# Altium schematic sheet DDR4 Memory.SchDoc
size A3; SheetNumber: 7; SheetTotal: 16
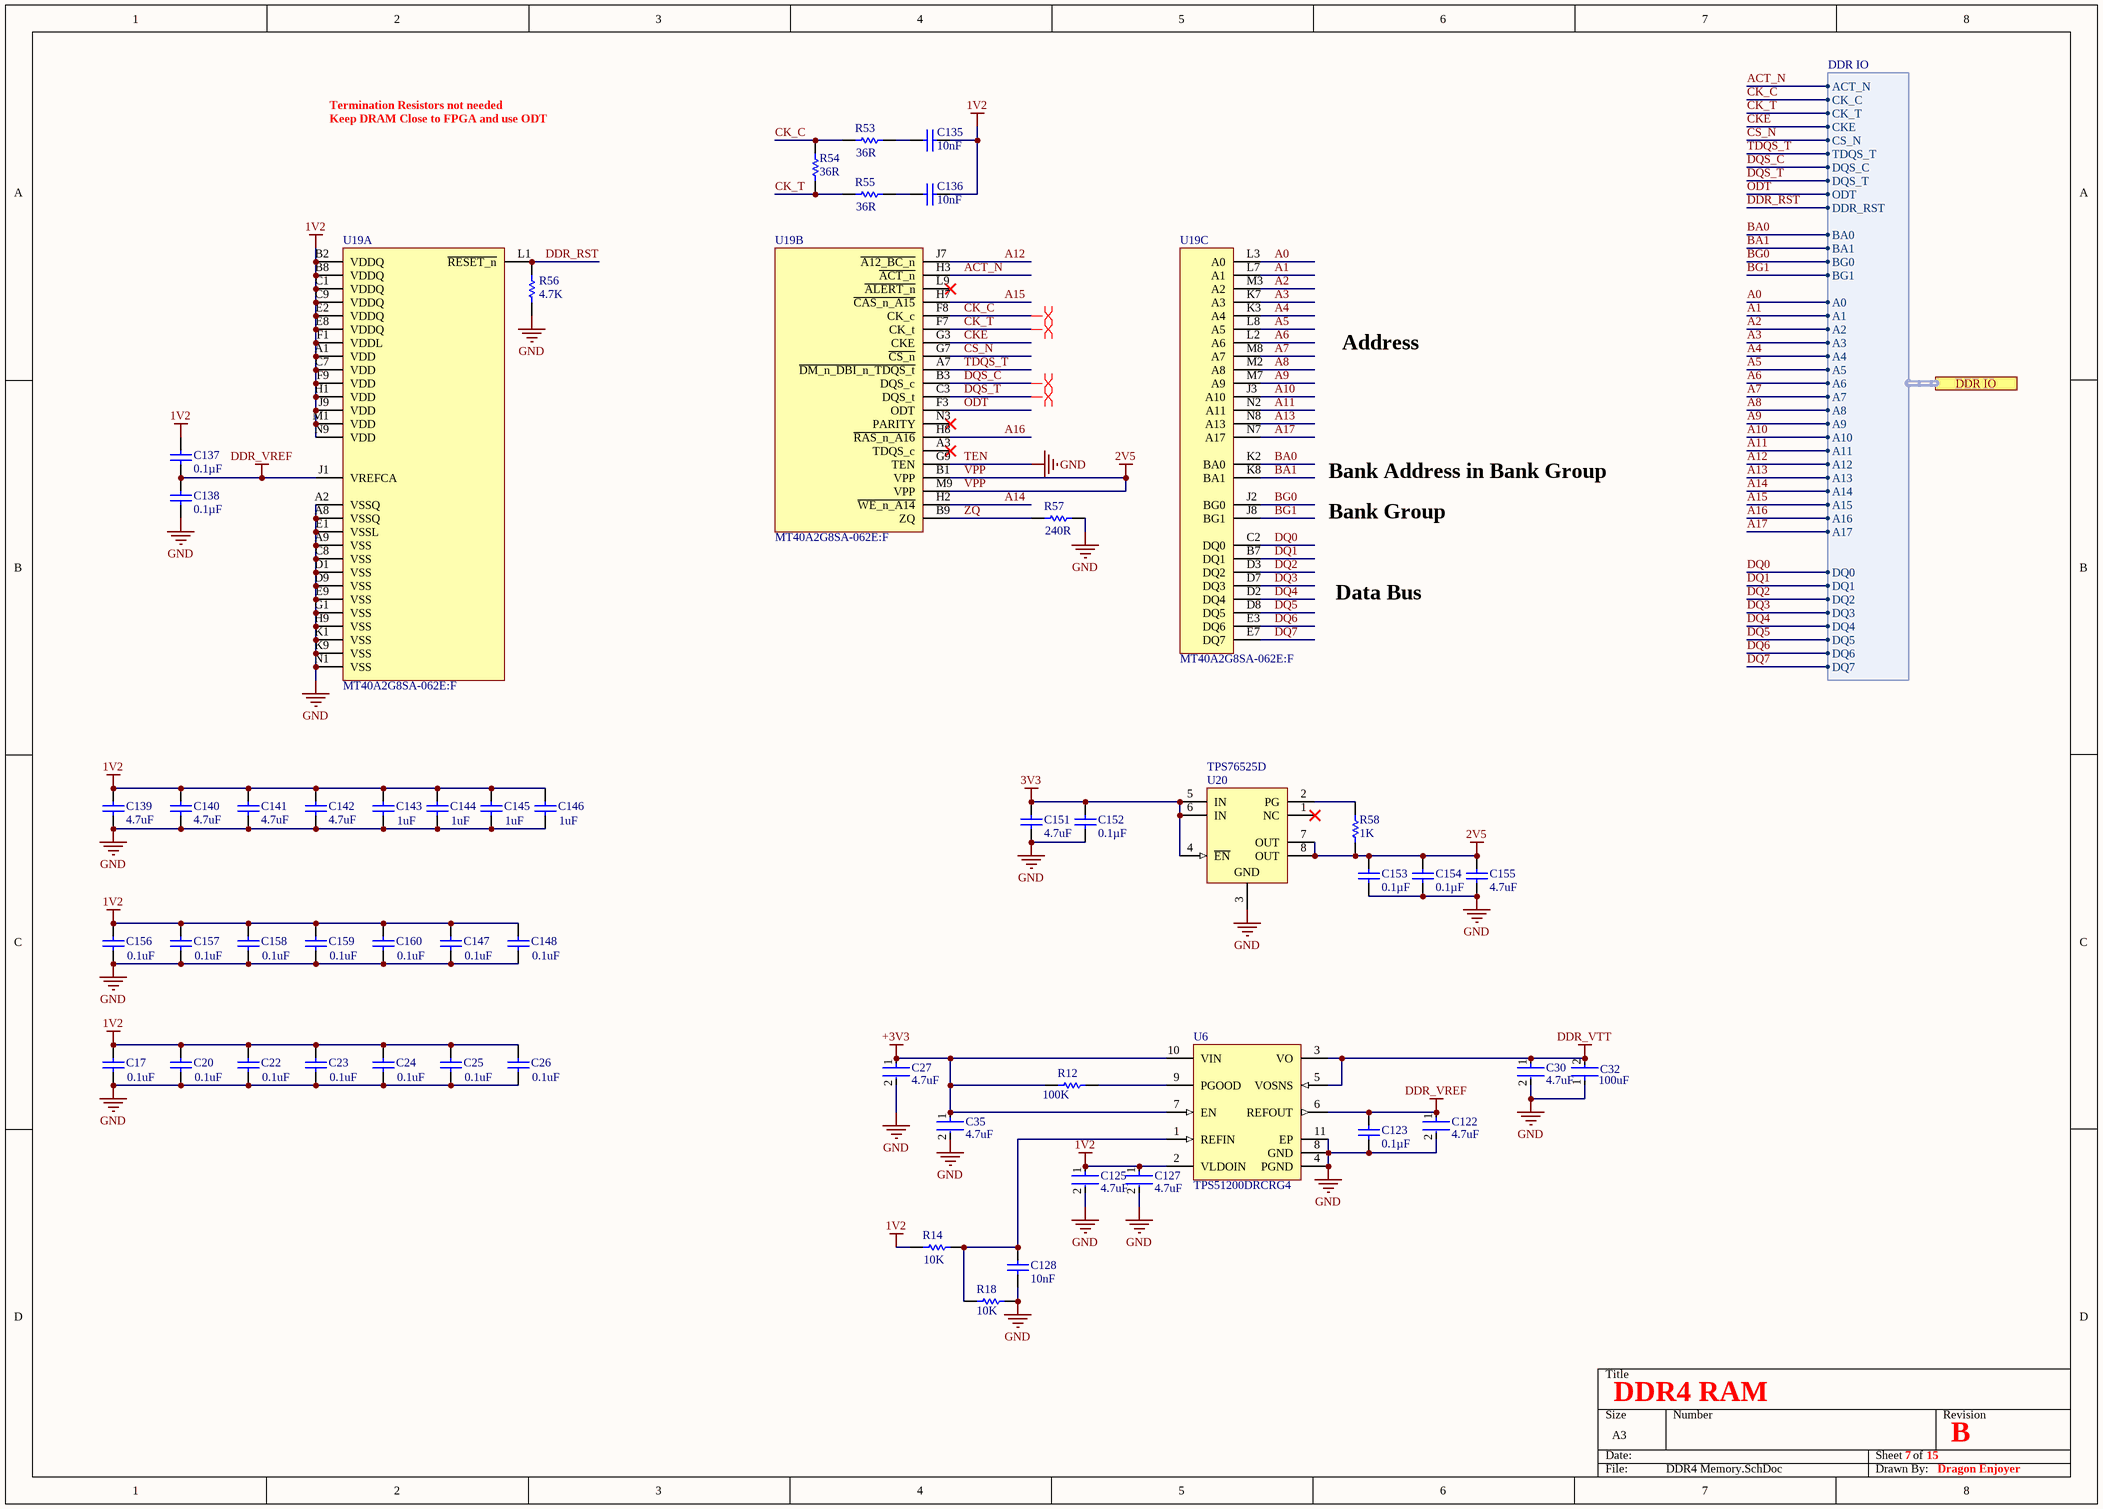
[diagram p0: DDR4 Memory.SchDoc]

## Parts
C17  value 0.1uF  [CAPC0603X33X15LL03T05]  (hidden comment: 02016D104KAT2A)
C20  value 0.1uF  [CAPC0603X33X15LL03T05]  (hidden comment: 02016D104KAT2A)
C22  value 0.1uF  [CAPC0603X33X15LL03T05]  (hidden comment: 02016D104KAT2A)
C23  value 0.1uF  [CAPC0603X33X15LL03T05]  (hidden comment: 02016D104KAT2A)
C24  value 0.1uF  [CAPC0603X33X15LL03T05]  (hidden comment: 02016D104KAT2A)
C25  value 0.1uF  [CAPC0603X33X15LL03T05]  (hidden comment: 02016D104KAT2A)
C26  value 0.1uF  [CAPC0603X33X15LL03T05]  (hidden comment: 02016D104KAT2A)
C27  Capacitance: 4.7uF  [FP-C1005-050-0_15-MFG]  (hidden comment: C1005X5R1A475K050BC)
C30  Capacitance: 4.7uF  [FP-C1005-050-0_15-MFG]  (hidden comment: C1005X5R1A475K050BC)
C32  Capacitance: 100uF  [FP-GRM21B-0_2-e0_2_0_7-IPC_C]  (hidden comment: GRM21BC80G107ME15L)
C35  Capacitance: 4.7uF  [FP-C1005-050-0_15-MFG]  (hidden comment: C1005X5R1A475K050BC)
C122  Capacitance: 4.7uF  [FP-C1005-050-0_15-MFG]  (hidden comment: C1005X5R1A475K050BC)
C123  Capacitance: 0.1µF  [CAPC1005X55X25LL05T05]  (hidden comment: CC0402ZRY5V8BB104)
C125  Capacitance: 4.7uF  [FP-C1005-050-0_15-MFG]  (hidden comment: C1005X5R1A475K050BC)
C127  Capacitance: 4.7uF  [FP-C1005-050-0_15-MFG]  (hidden comment: C1005X5R1A475K050BC)
C128  Capacitance: 10nF  [CAPC1608X90X35ML10T15]  (hidden comment: GRM188R71H103KA01D)
C135  value 10nF  [CAPC1005X55X25LL05T10]  (hidden comment: GRM155R71E103KA01D)
C136  value 10nF  [CAPC1005X55X25LL05T10]  (hidden comment: GRM155R71E103KA01D)
C137  Capacitance: 0.1µF  [CAPC1005X55X25LL05T05]  (hidden comment: CC0402ZRY5V8BB104)
C138  Capacitance: 0.1µF  [CAPC1005X55X25LL05T05]  (hidden comment: CC0402ZRY5V8BB104)
C139  value 4.7uF  [CAPC2013X135X45NL10T25]  (hidden comment: GRM21BR61E475KA12L)
C140  value 4.7uF  [CAPC2013X135X45NL10T25]  (hidden comment: GRM21BR61E475KA12L)
C141  value 4.7uF  [CAPC2013X135X45NL10T25]  (hidden comment: GRM21BR61E475KA12L)
C142  value 4.7uF  [CAPC2013X135X45NL10T25]  (hidden comment: GRM21BR61E475KA12L)
C143  value 1uF  [CAPC0402(1005)60_L]  (hidden comment: CAP 1uF 6.3V 0402(1005))
C144  value 1uF  [CAPC0402(1005)60_L]  (hidden comment: CAP 1uF 6.3V 0402(1005))
C145  value 1uF  [CAPC0402(1005)60_L]  (hidden comment: CAP 1uF 6.3V 0402(1005))
C146  value 1uF  [CAPC0402(1005)60_L]  (hidden comment: CAP 1uF 6.3V 0402(1005))
C147  value 0.1uF  [CAPC0603X33X15LL03T05]  (hidden comment: 02016D104KAT2A)
C148  value 0.1uF  [CAPC0603X33X15LL03T05]  (hidden comment: 02016D104KAT2A)
C151  value 4.7uF  [CAPC2013X135X45NL10T25]  (hidden comment: GRM21BR61E475KA12L)
C152  Capacitance: 0.1µF  [CAPC1005X55X25LL05T05]  (hidden comment: CC0402ZRY5V8BB104)
C153  Capacitance: 0.1µF  [CAPC1005X55X25LL05T05]  (hidden comment: CC0402ZRY5V8BB104)
C154  Capacitance: 0.1µF  [CAPC1005X55X25LL05T05]  (hidden comment: CC0402ZRY5V8BB104)
C155  value 4.7uF  [CAPC2013X135X45NL10T25]  (hidden comment: GRM21BR61E475KA12L)
C156  value 0.1uF  [CAPC0603X33X15LL03T05]  (hidden comment: 02016D104KAT2A)
C157  value 0.1uF  [CAPC0603X33X15LL03T05]  (hidden comment: 02016D104KAT2A)
C158  value 0.1uF  [CAPC0603X33X15LL03T05]  (hidden comment: 02016D104KAT2A)
C159  value 0.1uF  [CAPC0603X33X15LL03T05]  (hidden comment: 02016D104KAT2A)
C160  value 0.1uF  [CAPC0603X33X15LL03T05]  (hidden comment: 02016D104KAT2A)
R12  value 100K  [RESC1005X40X25LL05T05]  (hidden comment: CRCW0402100KJNED)
R14  value 10K  [RESC1005X40X25LL05T10]  (hidden comment: RC0402FR-0710KL)
R18  value 10K  [RESC1005X40X25LL05T10]  (hidden comment: RC0402FR-0710KL)
R53  value 36R  [RESC1005X40X25ML05T05]  (hidden comment: CRCW040236R0FKED)
R54  value 36R  [RESC1005X40X25ML05T05]  (hidden comment: CRCW040236R0FKED)
R55  value 36R  [RESC1005X40X25ML05T05]  (hidden comment: CRCW040236R0FKED)
R56  value 4.7K  [RESC1005X40X25LL05T10]  (hidden comment: RC0402JR-074K7L)
R57  value 240R  [RESC1005X40X25ML05T05]  (hidden comment: CRCW0402240RFKED)
R58  value 1K  [RESC1005X40X25NL05T10]  (hidden comment: RC0402FR-071KL)
U6  TPS51200DRCRG4  [TI-DRC10-2400X1650TP_V]
U19  MT40A2G8SA-062E:F  [BGA78C80P6X13_750X1100X110]  (parts A,B,C of 3)
U20  TPS76525D  [D0008A_N]

## Ports
DDR IO (harness DDR IO)

## Harnesses
DDR IO: ACT_N, CK_C, CK_T, CKE, CS_N, TDQS_T, DQS_C, DQS_T, ODT, BA0, BA1, BG0, BG1, A0, A1, A2, A3, A4, A5, A6, A7, A8, A9, A10, A11, A12, A13, A14, A15, A16, A17, DQ0, DQ1, DQ2, DQ3, DQ4, DQ5, DQ6, DQ7, DDR_RST

## Nets
1V2: C17.2 C20.2 C22.2 C23.2 C24.2 C25.2 C26.2 C125.1 C127.1 C135.2 C136.2 C137.2 C139.1 C140.1 C141.1 C142.1 C143.2 C144.2 C145.2 C146.2 C147.2 C148.2 C156.2 C157.2 C158.2 C159.2 C160.2 R14.1 U6.2(VLDOIN) U19.A1(VDD) U19.B2(VDDQ) U19.B8(VDDQ) U19.C1(VDDQ) U19.C7(VDD) U19.C9(VDDQ) U19.E2(VDDQ) U19.E8(VDDQ) U19.F1(VDDL) U19.F9(VDD) U19.H1(VDD) U19.J9(VDD) U19.M1(VDD) U19.N9(VDD)
3V3: C151.1 C152.2 U20.4(~{EN}) U20.5(IN) U20.6(IN)
+3V3: C27.1 C35.1 R12.1 U6.7(EN) U6.10(VIN)
DDR_VREF: C122.1 C123.2 C137.1 C138.2 U6.6(REFOUT) U19.J1(VREFCA)
DDR_VTT: C30.1 C32.2 U6.3(VO) U6.5(VOSNS)
TEN: C17.1 C20.1 C22.1 C23.1 C24.1 C25.1 C26.1 C27.2 C30.2 C32.1 C35.2 C122.2 C123.1 C125.2 C127.2 C128.2 C138.1 C139.2 C140.2 C141.2 C142.2 C143.1 C144.1 C145.1 C146.1 C147.1 C148.1 C151.2 C152.1 C153.1 C154.1 C155.2 C156.1 C157.1 C158.1 C159.1 C160.1 R18.1 R56.1 R57.2 U6.4(PGND) U6.8(GND) U6.11(EP) U19.A2(VSSQ) U19.A8(VSSQ) U19.A9(VSS) U19.C8(VSS) U19.D1(VSS) U19.D9(VSS) U19.E1(VSSL) U19.E9(VSS) U19.G1(VSS) U19.G9(TEN) U19.H9(VSS) U19.K1(VSS) U19.K9(VSS) U19.N1(VSS) U20.3(GND)  [also labelled GND]
VPP: C153.2 C154.2 C155.1 R58.1 U19.B1(VPP) U19.M9(VPP) U20.7(OUT) U20.8(OUT)  [also labelled 2V5]
A0: U19.L3(A0) ; port DDR IO.A0
A1: U19.L7(A1) ; port DDR IO.A1
A2: U19.M3(A2) ; port DDR IO.A2
A3: U19.K7(A3) ; port DDR IO.A3
A4: U19.K3(A4) ; port DDR IO.A4
A5: U19.L8(A5) ; port DDR IO.A5
A6: U19.L2(A6) ; port DDR IO.A6
A7: U19.M8(A7) ; port DDR IO.A7
A8: U19.M2(A8) ; port DDR IO.A8
A9: U19.M7(A9) ; port DDR IO.A9
A10: U19.J3(A10) ; port DDR IO.A10
A11: U19.N2(A11) ; port DDR IO.A11
A12: U19.J7(~{A12_BC_n}) ; port DDR IO.A12
A13: U19.N8(A13) ; port DDR IO.A13
A14: U19.H2(~{WE_n_A14}) ; port DDR IO.A14
A15: U19.H7(~{CAS_n_A15}) ; port DDR IO.A15
A16: U19.H8(~{RAS_n_A16}) ; port DDR IO.A16
A17: U19.N7(A17) ; port DDR IO.A17
ACT_N: U19.H3(~{ACT_n}) ; port DDR IO.ACT_N
BA0: U19.K2(BA0) ; port DDR IO.BA0
BA1: U19.K8(BA1) ; port DDR IO.BA1
BG0: U19.J2(BG0) ; port DDR IO.BG0
BG1: U19.J8(BG1) ; port DDR IO.BG1
CK_C: R53.1 R54.2 U19.F8(CK_c) ; port DDR IO.CK_C
CK_T: R54.1 R55.1 U19.F7(CK_t) ; port DDR IO.CK_T
CKE: U19.G3(CKE) ; port DDR IO.CKE
CS_N: U19.G7(~{CS_n}) ; port DDR IO.CS_N
DDR_RST: R56.2 U19.L1(~{RESET_n}) ; port DDR IO.DDR_RST
DQ0: U19.C2(DQ0) ; port DDR IO.DQ0
DQ1: U19.B7(DQ1) ; port DDR IO.DQ1
DQ2: U19.D3(DQ2) ; port DDR IO.DQ2
DQ3: U19.D7(DQ3) ; port DDR IO.DQ3
DQ4: U19.D2(DQ4) ; port DDR IO.DQ4
DQ5: U19.D8(DQ5) ; port DDR IO.DQ5
DQ6: U19.E3(DQ6) ; port DDR IO.DQ6
DQ7: U19.E7(DQ7) ; port DDR IO.DQ7
DQS_C: U19.B3(DQS_c) ; port DDR IO.DQS_C
DQS_T: U19.C3(DQS_t) ; port DDR IO.DQS_T
ODT: U19.F3(ODT) ; port DDR IO.ODT
TDQS_T: U19.A7(~{DM_n_DBI_n_TDQS_t}) ; port DDR IO.TDQS_T
ZQ: R57.1 U19.B9(ZQ)
NetC128_1: C128.1 R14.2 R18.2 U6.1(REFIN)
NetC135_1: C135.1 R53.2
NetC136_1: C136.1 R55.2
NetR12_2: R12.2 U6.9(PGOOD)
NetR58_2: R58.2 U20.2(PG)

Not connected (* = marked no-connect by the designer): U19 A3(TDQS_c)* L9(~{ALERT_n})* N3(PARITY)*; U20 1(NC)*

## Layout directives
differential pair: CK_C, CK_T, DQS_C, DQS_T

## Notes on the sheet
- Termination Resistors not needed
- Keep DRAM Close to FPGA and use ODT
- Address
- Bank Address in Bank Group
- Bank Group
- Data Bus
- DDR4 RAM
- 7
- 15
- B
- Dragon Enjoyer

## Library data of the parts
C17 C20 C22-C26 C147 C148 C156-C160 = CMP-2010-00159-1: Manufacturer: AVX Interconnect / Elco; Part Number: 02016D104KAT2A
C27 C30 C35 C122 C125 C127 = CMP-2000-05997-2: CAP CER 4.7UF 10V X5R 0402; Dielectric Material: Ceramic; Tolerance: 10%; Series: C; Package Quantity: 10000; Max Operating Temperature: 85°C; Case Code (Imperial): 0402; Lead Free: Lead Free; Voltage Rating (DC): 10V; Packaging: Cut Tape; Voltage Rating: 10V; Min Operating Temperature: -55°C; Dielectric: X5R; Thickness: 0.022inch; Width: 0.02inch; Case/Package: 0402; Case Code (Metric): 1005; Length: 0.039inch; RoHS Compliant: Yes; REACH SVHC: No SVHC; Mount: Surface Mount
C32 = CMP-06035-010229-1: Chip Multilayer Ceramic Capacitors for General Purpose, 0805, 100uF, X6S, 22%, 20%, 4V; Case/Package: 0805; Packaging: Cut Tape; REACH SVHC: No SVHC; Min Operating Temperature: -55°C; Length: 0.079inch; Max Operating Temperature: 105°C; Case Code (Imperial): 0805; Width: 0.049inch; Case Code (Metric): 2012; Tolerance: 20%; Voltage Rating: 4V; Mount: Surface Mount; Voltage Rating (DC): 4V; Thickness: 0.057inch; Dielectric: X6S
C123 C137 C138 C152-C154 = CMP-2000-06071-1: Chip Capacitor, 100 nF, -20% to 80%, 25 V, -30 to 85 degC, 0402 (1005 Metric), RoHS, Tape and Reel; Manufacturer: Yageo; Online Catalog: CCSeries; Tolerance: -20%,+80%; Voltage - Rated: 25V; Product Training Modules: MultilayerCeramicCapacitors; Catalog Drawings: CC_0402; Other Names: 311-1375-6; Temperature Coefficient: Y5V(F); Datasheet URL: http://www.farnell.com/datasheets/1132289.pdf; Features: -; Package Description: 2-Pin Surface Mount Device, Body 1 x 0.5 mm; Standard Package: 1; Mounting Technology: SurfaceMount; Lead Style: -; Thickness (Max): 0.022"(0.55mm); Family: CeramicCapacitors; Series: CC; Applications: GeneralPurpose; Lead Spacing: -; Size / Dimension: 0.039"Lx0.020"W(1.00mmx0.50mm); Manufacturer URL: http://www.yageo.com/; Category: Capacitors; Datasheet Version: Rev. 5, 07/2010; Height - Seated (Max): -; Packaging: Digi-Reel®; Operating Temperature: -30°C~85°C; Mounting Type: SurfaceMount,MLCC; Package Reference: 0402; Ratings: -; Package / Case: 0402(1005Metric)
C128 = CMP-2100-03642-1: Chip Capacitor, 10 nF, +/- 10%, 50 V, -55 to 125 degC, 0603 (1608 Metric), RoHS, Tape and Reel; Manufacturer: Murata; Insulation Resistance: 10GR; Dielectric: X7R; Voltage Rating: 50V; Material: Ceramic; Package Quantity: 1; Lead Free: LeadFree; Case/Package: 0603; Termination: SMD/SMT; REACH SVHC: Unknown; Manufacturer URL: http://www.murata.com/; Datasheet URL: http://search.murata.co.jp/Ceramy/image/img/A01X/G101/ENG/GRM188R71H103KA01-01.pdf; Mount: SurfaceMount; Datasheet Version: 42401.0; Number of Pins: 2; Length: 1.6mm; Voltage: 50V; Depth: 0.8mm; Tolerance: 10%; Min Operating Temperature: -55degC; Voltage Rating (DC): 50V; Max Operating Temperature: 125degC; Package Description: 2-Pin Surface Mount Device, Body 1.6 x 0.8 mm; RoHSCompliant: True; Case Code (Imperial): 0603; Width: 0.031inch; Case Code (Metric): 1608; Height: 0.8mm; Package Reference: 0603; Packaging: TapeandReel; Thickness: 0.035inch; Dielectric Material: Ceramic
C135 C136 = CMP-1034-01880-2: Manufacturer: Murata; Part Number: GRM155R71E103KA01D
C139-C142 C151 C155 = CMP-2007-03545-1: Manufacturer: Murata; Part Number: GRM21BR61E475KA12L
C143-C146 = CMP-1034-02115-1: CAP 1uF 6.3V -20% to +80% 0402 (1005 Metric) Thickness 0.6mm SMD; Case-EIA: 0402; Case-Metric: 1005; Rated Voltage: 6.3 V; Tolerance: -20% to +80%; Technology: SMT; Max Thickness: 0.6 mm
R12 = CMP-2002-08125-1: Manufacturer: Vishay Dale; Part Number: CRCW0402100KJNED
R14 R18 = CMP-2002-07353-1: Manufacturer: Yageo / Phycomp; Part Number: RC0402FR-0710KL
R53-R55 = CMP-2002-00305-1: Manufacturer: Vishay Dale; Part Number: CRCW040236R0FKED
R56 = CMP-2002-08011-1: Manufacturer: Yageo / Phycomp; Part Number: RC0402JR-074K7L
R57 = CMP-2002-08397-1: Manufacturer: Vishay Dale; Part Number: CRCW0402240RFKED
R58 = CMP-2002-07472-1: Manufacturer: Yageo / Phycomp; Part Number: RC0402FR-071KL
U6 = CMP-0395-00657-1: Single Output LDO, 3 A, 2.375 to 3.5 V Input, with DDR Termination, 10-pin SON (DRC), -40 to 85 degC, Green (RoHS & no Sb/Br); Manufacturer: Texas Instruments; Iq(Typ)(mA): 0.5; Power Good: TRUE; SubFamily: Single Channel LDO; Iout(Max)(A): 3; Vin(Max)(V): 3.5; Rating: Catalog; Vin(Min)(V): 2.3; PackageVersion: 4204102-3/L; ComponentLink2Description: Datasheet; ComponentLink3URL: http://www.ti.com/litv/pdf/mpds117k; ComponentLink1Description: Manufacturer URL; PackageDescription: 10-Pin Plastic Small Outline, Body 3 x 3 mm, Pitch 0.5 mm; ComponentLink1URL: http://www.ti.com/; ComponentLink4URL: Samples URL:http://www.ti.com/product/tps51200#samples; PackageReference: DRC10-2400X1650TP; ComponentLink4Description: URL Link1; ComponentLink3Description: Package Specification; DatasheetVersion: SLUS812; Eco-Plan: Green (RoHS & no Sb/Br); PartNumber: TPS51200DRCRG4; ComponentLink2URL: http://www.ti.com/general/docs/lit/getliterature.tsp?genericPartNumber=TPS51200&fileType=pdf; Mounting Technology: Surface Mount
U19 = CMP-019-00061-1: MICMT40A2G8SA-062E: F DDR4 16G 2GX8 Fbga; PartId: 1
U20 = CMP-0394-00064-2: Single Output LDO, 150 mA, Fixed 2.5 V Output, 2.7 to 10 V Input, with Low IQ, 8-pin SOIC (D), -40 to 125 degC, Green (RoHS & no Sb/Br); Manufacturer: Texas Instruments; Vdo(Typ)(mV): 85; Iq(Typ)(mA): 0.03; Rating: Catalog; Vin(Max)(V): 10; Vin(Min)(V): 2.7; Power Good: TRUE; Iout(Max)(A): 0.15; Vout Adj(Min)(V): 2.5; SubFamily: Single Channel LDO; ComponentLink4URL: Samples URL:http://www.ti.com/product/tps76525#samples; ComponentLink3Description: Package Specification; ComponentLink1Description: Manufacturer URL; ComponentLink3URL: http://www.ti.com/litv/pdf/msoi002j; PackageReference: D0008A; ComponentLink1URL: http://www.ti.com/; Eco-Plan: Green (RoHS & no Sb/Br); PackageVersion: 4040047-3/M; ComponentLink2URL: http://www.ti.com/general/docs/lit/getliterature.tsp?genericPartNumber=TPS76525&fileType=pdf; ComponentLink4Description: URL Link1; Code_JEDEC: MS-012; DatasheetVersion: SLVS236; PackageDescription: 8-Pin Plastic Small Outline, Body 4.9 x 3.9 mm, Pitch 1.27 mm; Mounting Technology: Surface Mount; ComponentLink2Description: Datasheet; PartNumber: TPS76525D; Fixed Output Options(V): 2.5; Vout Adj(Max)(V): 2.5